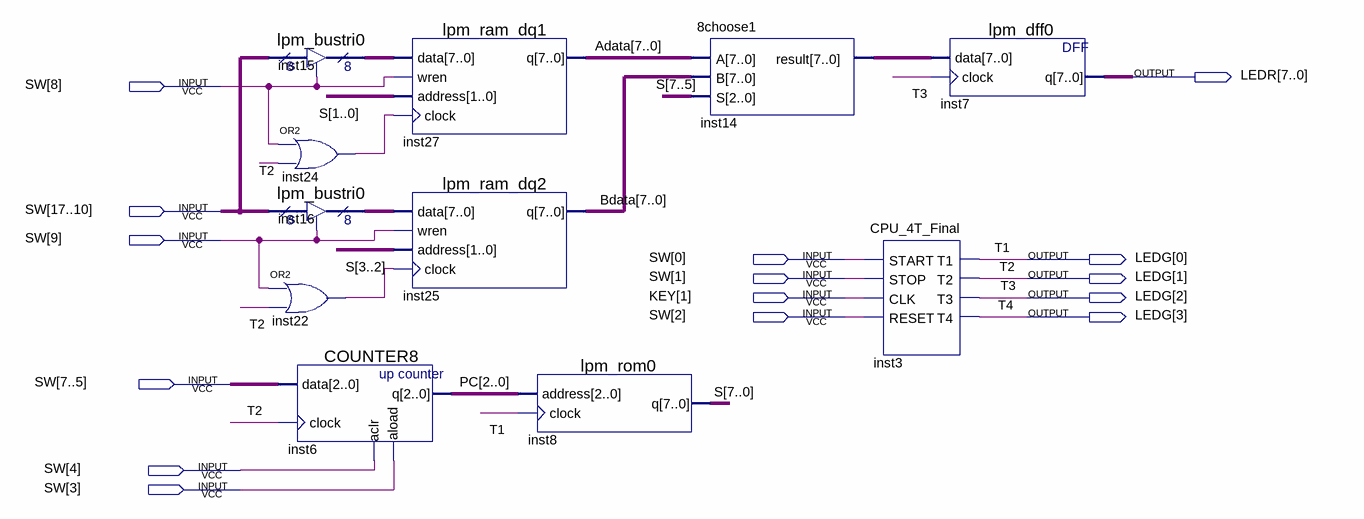
[diagram p0: schematic sheet]
// Quartus schematic CPU_Final.bdf as structural Verilog: 11 symbols, 15 pins
module CPU_Final (
  input  [17:0] SW,
  input  [1:1] KEY,
  output [7:0] LEDR,
  output [3:0] LEDG
);

  wire inst22_out, inst24_out;
  wire [2:0] PC;
  wire [7:0] Adata, Bdata, inst14_result, inst15_tridata, inst16_tridata, S;

  lpm_bustri0 inst15 (.enabledt(SW[8]), .data(SW[17:10]), .tridata(inst15_tridata));
  or inst24 (inst24_out, SW[8], LEDG[1]);
  lpm_bustri0 inst16 (.enabledt(SW[9]), .data(SW[17:10]), .tridata(inst16_tridata));
  or inst22 (inst22_out, SW[9], LEDG[1]);
  COUNTER8 inst6 (.data(SW[7:5]), .clock(LEDG[1]), .aclr(SW[4]), .aload(SW[3]), .q(PC));
  lpm_ram_dq1 inst27 (.data(inst15_tridata), .wren(SW[8]), .address(S[1:0]), .clock(inst24_out), .q(Adata));
  lpm_ram_dq2 inst25 (.data(inst16_tridata), .wren(SW[9]), .address(S[3:2]), .clock(inst22_out), .q(Bdata));
  lpm_rom0 inst8 (.address(PC), .clock(LEDG[0]), .q(S));
  \8choose1  inst14 (.A(Adata), .B(Bdata), .S(S[7:5]), .result(inst14_result));
  CPU_4T_Final inst3 (
    .START(SW[0]), .STOP(SW[1]), .CLK(KEY[1]), .RESET(SW[2]), .T1(LEDG[0]), .T2(LEDG[1]), .T3(LEDG[2]),
    .T4(LEDG[3]));
  lpm_dff0 inst7 (.data(inst14_result), .clock(LEDG[2]), .q(LEDR));

  // Other names for the same wires on the sheet: T1 = LEDG[0]; T2 = LEDG[1]; T3 = LEDG[2]; T4 = LEDG[3]
endmodule
